# EAGLE design untitled (EAGLE 8.6.3)
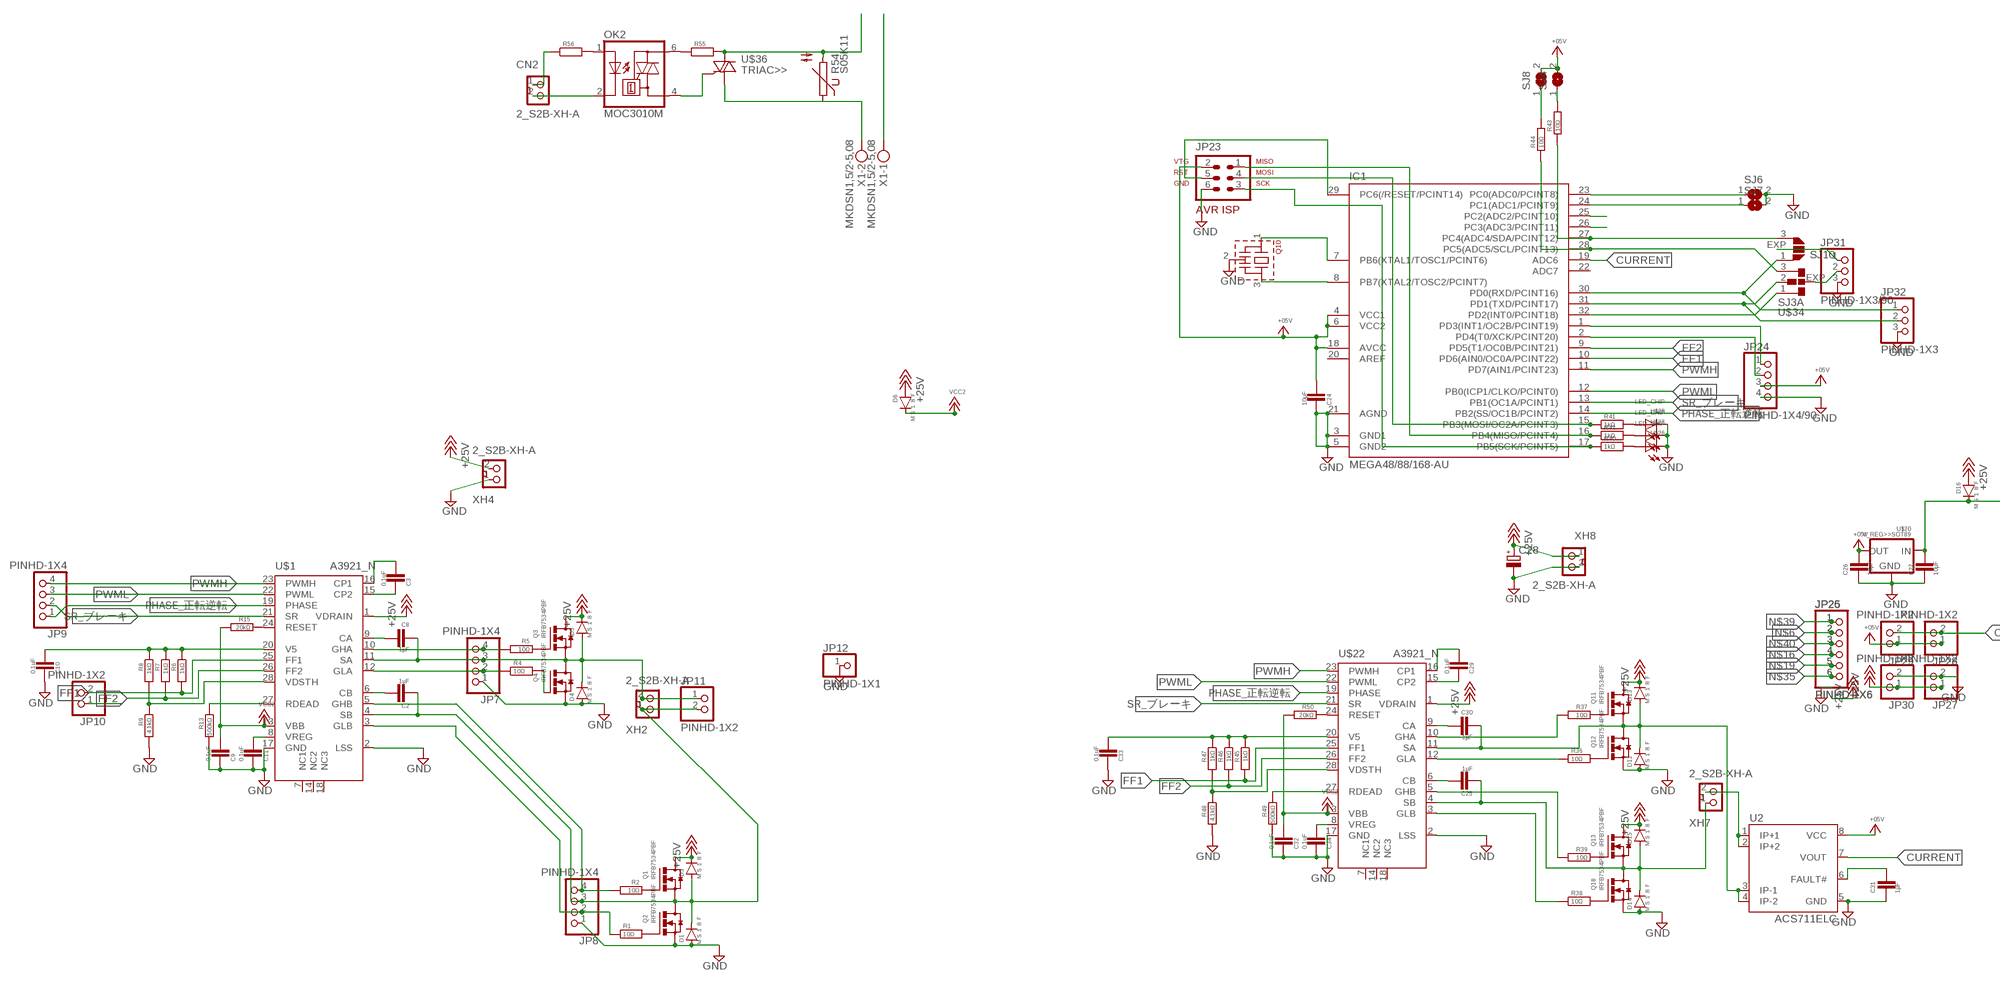
[diagram p0: schematic, sheet 1, part 1 of 2]
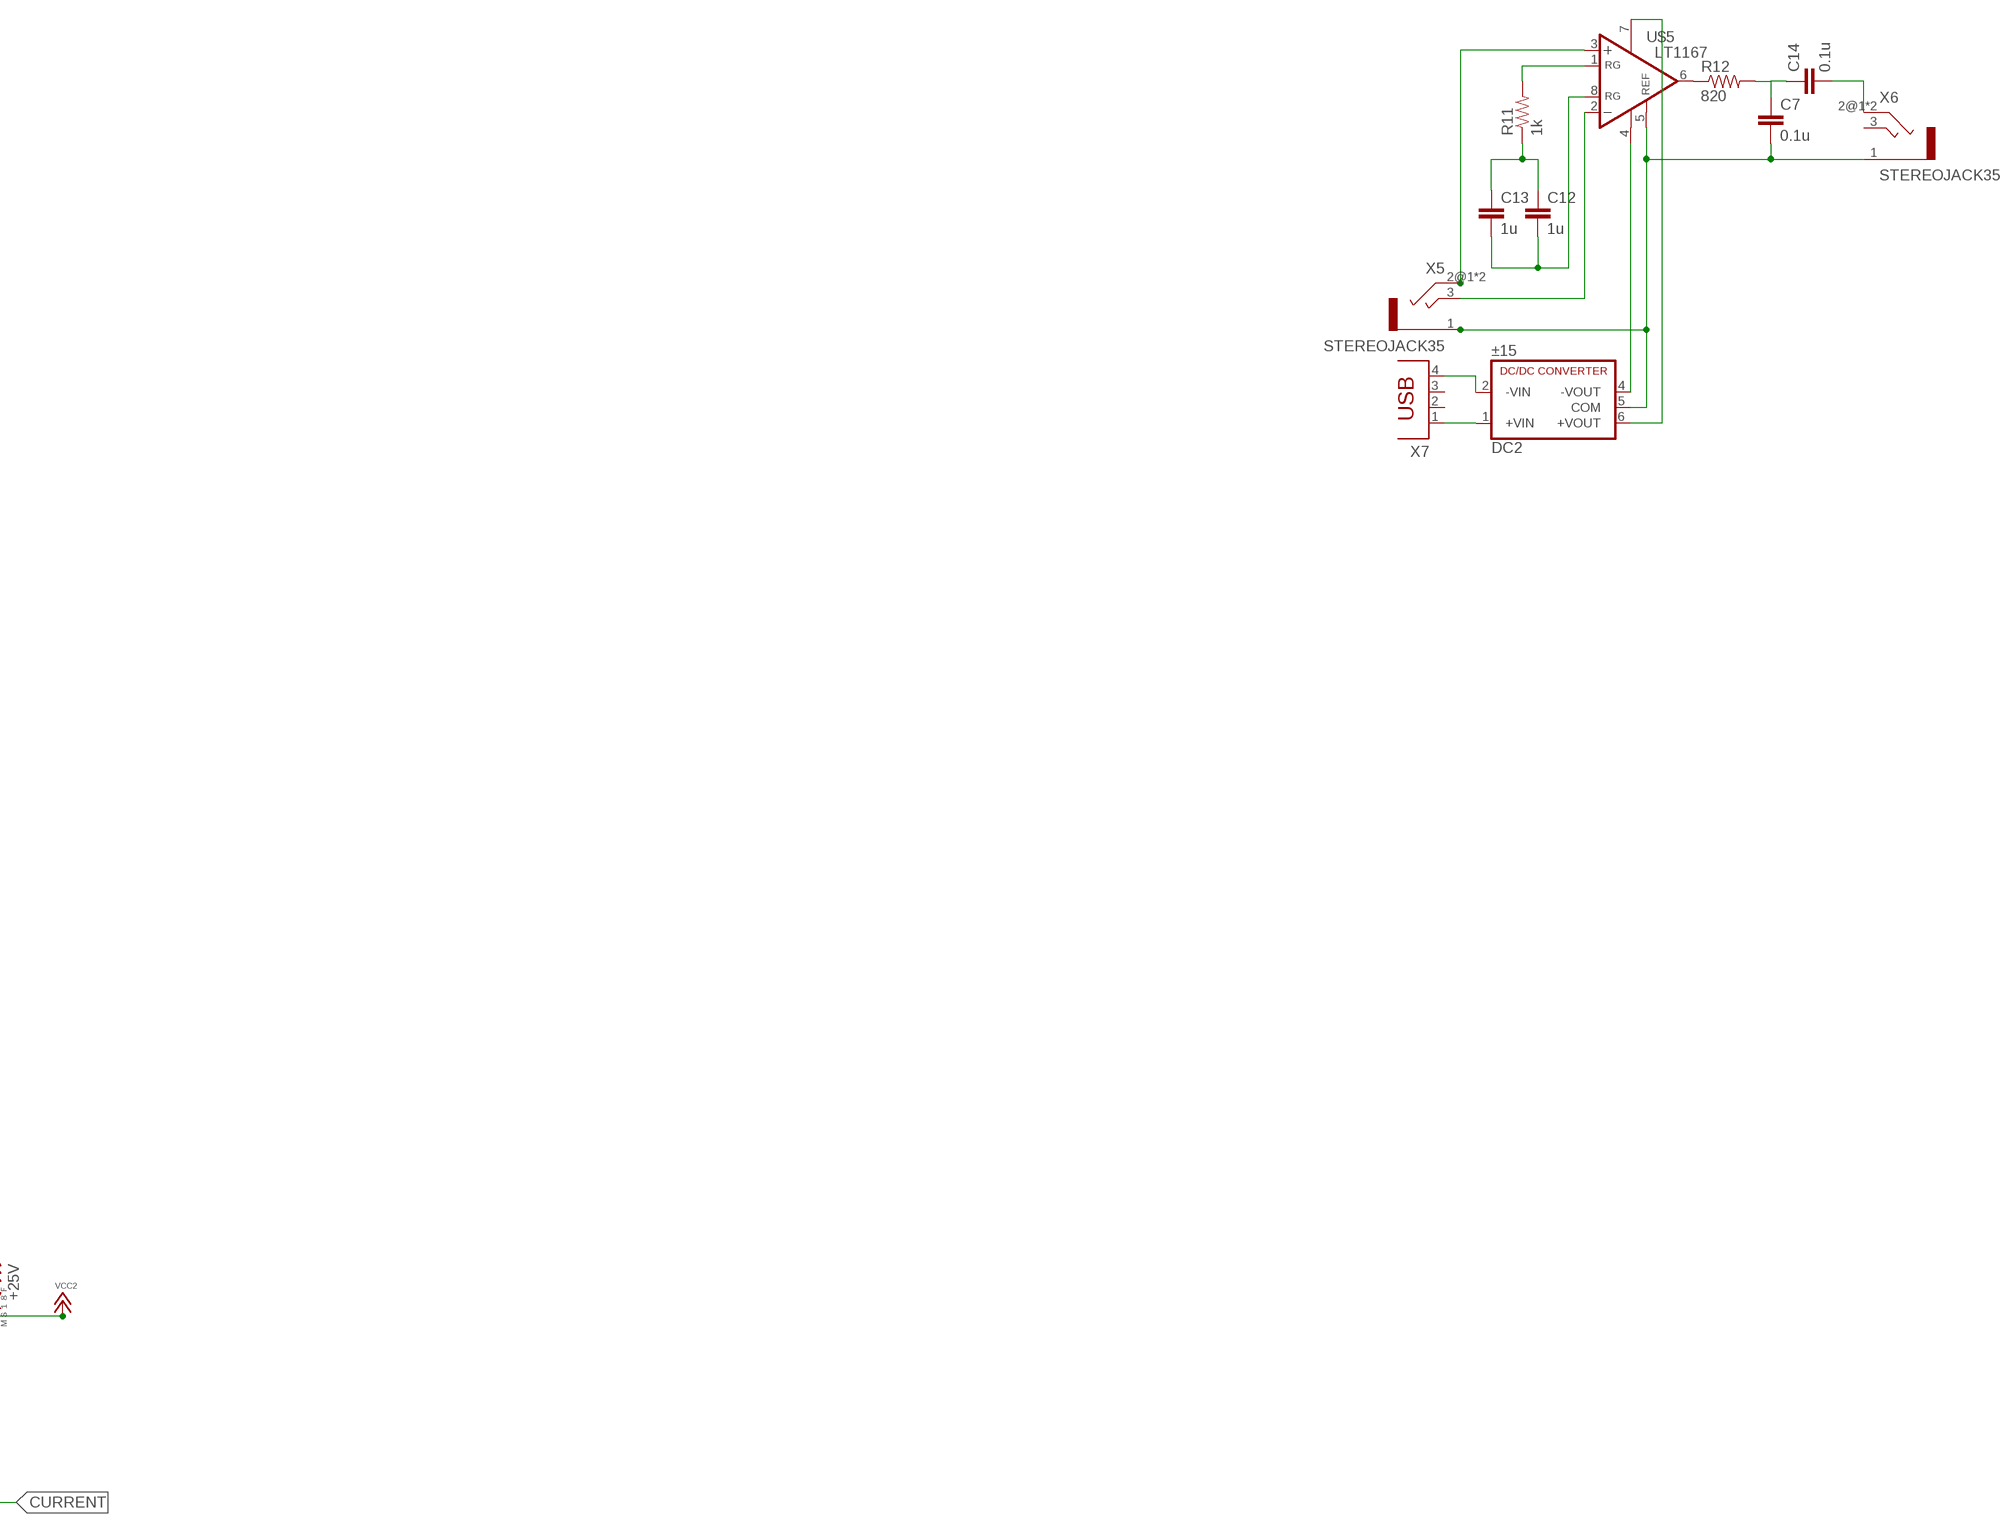
[diagram p1: schematic, sheet 1, part 2 of 2]

## Parts
C2  1μF  CAPACITOR>>2012  [2012]
C3  0.1uF  CAPACITOR>>2012  [2012]
C7  0.1u  C-EU050-024X044  [C050-024X044]
C8  1μF  CAPACITOR>>2012  [2012]
C9  0.1uF  CAPACITOR>>2012  [2012]
C10  0.1uF  CAPACITOR>>2012  [2012]
C11  0.1uF  CAPACITOR>>2012  [2012]
C12  1u  C-EU050-024X044  [C050-024X044]
C13  1u  C-EU050-024X044  [C050-024X044]
C14  0.1u  C-EU050-024X044  [C050-024X044]
C24  10μF  CAPACITOR>>2012  [2012]
C25  1μF  CAPACITOR>>2012  [2012]
C26  10μF  CAPACITOR>>2012  [2012]
C27  10μF  CAPACITOR>>2012  [2012]
C28  CPOL-EUUD-6,3X8,8  [UD-6,3X5,8_NICHICON]
C29  0.1uF  CAPACITOR>>2012  [2012]
C30  1μF  CAPACITOR>>2012  [2012]
C31  1μF  CAPACITOR>>2012  [2012]
C32  0.1uF  CAPACITOR>>2012  [2012]
C33  0.1uF  CAPACITOR>>2012  [2012]
C34  0.1uF  CAPACITOR>>2012  [2012]
CN2  2_S2B-XH-A  [S2B-XH-A]
D1  ＭＳ１８Ｆ  DIODE>>MS18F  [MS18F]
D3  ＭＳ１８Ｆ  DIODE>>MS18F  [MS18F]
D4  ＭＳ１８Ｆ  DIODE>>MS18F  [MS18F]
D5  ＭＳ１８Ｆ  DIODE>>MS18F  [MS18F]
D6  ＭＳ１８Ｆ  DIODE>>MS18F  [MS18F]
D12  ＭＳ１８Ｆ  DIODE>>MS18F  [MS18F]
D13  ＭＳ１８Ｆ  DIODE>>MS18F  [MS18F]
D14  ＭＳ１８Ｆ  DIODE>>MS18F  [MS18F]
D15  ＭＳ１８Ｆ  DIODE>>MS18F  [MS18F]
D16  ＭＳ１８Ｆ  DIODE>>MS18F  [MS18F]
DC2  ±15  MAU109  [NMA]
IC1  MEGA48/88/168-AU  [TQFP32-08]
JP7  PINHD-1X4  [1X04]
JP8  PINHD-1X4  [1X04]
JP9  PINHD-1X4  [1X04]
JP10  PINHD-1X2  [1X02]
JP11  PINHD-1X2  [1X02]
JP12  PINHD-1X1  [1X01]
JP23  AVR-ISP-6  [AVR-ISP-6]
JP24  PINHD-1X4/90  [1X04/90]
JP25  PINHD-1X6  [1X06]
JP26  PINHD-1X6  [1X06]
JP27  PINHD-1X2  [1X02]
JP28  PINHD-1X2  [1X02]
JP29  PINHD-1X2  [1X02]
JP30  PINHD-1X2  [1X02]
JP31  PINHD-1X3/90  [1X03/90]
JP32  PINHD-1X3  [1X03]
OK2  MOC3010M  [DIL06]
Q1  IRFB7534PBF  MOSFET_N>>TO252  [TO252]
Q2  IRFB7534PBF  MOSFET_N>>TO252  [TO252]
Q3  IRFB7534PBF  MOSFET_N>>TO252  [TO252]
Q4  IRFB7534PBF  MOSFET_N>>TO252  [TO252]
Q10  CSTLS_G  [CSTLS_G8]
Q11  IRFB7534PBF  MOSFET_N>>TO252  [TO252]
Q12  IRFB7534PBF  MOSFET_N>>TO252  [TO252]
Q13  IRFB7534PBF  MOSFET_N>>TO252  [TO252]
Q18  IRFB7534PBF  MOSFET_N>>TO252  [TO252]
R1  10Ω  REGISTER>>2012  [2012]
R2  10Ω  REGISTER>>2012  [2012]
R4  10Ω  REGISTER>>2012  [2012]
R5  10Ω  REGISTER>>2012  [2012]
R6  1kΩ  REGISTER>>2012  [2012]
R7  1kΩ  REGISTER>>2012  [2012]
R8  1kΩ  REGISTER>>2012  [2012]
R9  4.1kΩ  REGISTER>>2012  [2012]
R11  1k  R-US_0207/7  [0207/7]
R12  820  R-US_0207/7  [0207/7]
R13  500kΩ  REGISTER>>2012  [2012]
R15  20kΩ  REGISTER>>2012  [2012]
R36  10Ω  REGISTER>>2012  [2012]
R37  10Ω  REGISTER>>2012  [2012]
R38  10Ω  REGISTER>>2012  [2012]
R39  10Ω  REGISTER>>2012  [2012]
R40  1kΩ  REGISTER>>2012  [2012]
R41  1kΩ  REGISTER>>2012  [2012]
R42  1kΩ  REGISTER>>2012  [2012]
R43  10Ω  REGISTER>>2012  [2012]
R44  10Ω  REGISTER>>2012  [2012]
R45  1kΩ  REGISTER>>2012  [2012]
R46  1kΩ  REGISTER>>2012  [2012]
R47  1kΩ  REGISTER>>2012  [2012]
R48  4.1kΩ  REGISTER>>2012  [2012]
R49  500kΩ  REGISTER>>2012  [2012]
R50  20kΩ  REGISTER>>2012  [2012]
R54  S05K11  [S05K11]
R55  R-EU>>1/4W(8MM)  [1/4W(8MM)]
R56  R-EU>>1/4W(8MM)  [1/4W(8MM)]
SJ4  SJSS  [SJ_B]
SJ6  SJSS  [SJ_B]
SJ7  SJSS  [SJ_B]
SJ8  SJSS  [SJ_B]
SJ10  SJ2  [SJ2_A]
U2  ACS711ELC  [SOIC8]
U$1  A3921_N  [TSSOP28_N]
U$5  LT1167  [DIL08]
U$20  V_REG>>SOT89  [SOT89]
U$22  A3921_N  [TSSOP28_N]
U$26  LED_CHIP  [2012]
U$27  LED_CHIP  [2012]
U$28  LED_CHIP  [2012]
U$34  SJ3A  [SJ3_A]
U$36  TRIAC>>  [TO-220_BT]
X1  MKDSN1,5/2-5,08  [MKDSN1,5/2-5,08]
X5  STEREOJACK35  [STEREOJACK35]
X6  STEREOJACK35  [STEREOJACK35]
X7  PN87520  [PN87520]
XH2  2_S2B-XH-A  [S2B-XH-A]
XH4  2_S2B-XH-A  [S2B-XH-A]
XH7  2_S2B-XH-A  [S2B-XH-A]
XH8  2_S2B-XH-A  [S2B-XH-A]

## Nets
+5V: C24.1 C26.1 IC1.4(VCC1) IC1.6(VCC2) IC1.18(AVCC) JP23.2 JP24.3 JP28.1 JP29.1 SJ4.2 SJ8.2 U2.8(VCC) U$20.1(OUT) ; supply symbol labelled +05V
+18V: C28.+ D3.P$2(C) D5.P$2(C) D6.P$1(A) D13.P$2(C) D15.P$2(C) D16.P$1(A) JP27.1 JP30.1 Q1.3(D) Q3.3(D) Q11.3(D) Q13.3(D) U$1.1(VDRAIN) U$22.1(VDRAIN) XH4.2 XH8.1 ; supply symbol labelled +25V
CURRENT: IC1.19(ADC6) JP28.2 JP29.2 U2.7(VOUT)
FF1: IC1.10(PD6(AIN0/OC0A/PCINT22)) JP10.2 R6.2 R45.2 U$1.25(FF1) U$22.25(FF1)
FF2: IC1.9(PD5(T1/OC0B/PCINT21)) JP10.1 R7.2 R46.2 U$1.26(FF2) U$22.26(FF2)
GND: C9.2 C10.2 C11.2 C24.2 C26.2 C27.2 C28.- C31.2 C32.2 C33.2 C34.2 D1.P$1(A) D4.P$1(A) D12.P$1(A) D14.P$1(A) IC1.3(GND1) IC1.5(GND2) IC1.21(AGND) JP7.1 JP8.1 JP12.1 JP23.6 JP24.4 JP27.2 JP30.2 JP31.3 JP32.3 Q2.2(S) Q4.2(S) Q10.2(VSS) Q12.2(S) Q18.2(S) R9.2 R13.2 R48.2 R49.2 SJ6.2 SJ7.2 U2.5(GND) U$1.2(LSS) U$1.17(GND) U$20.2(GND) U$20.2.1(GND) U$22.2(LSS) U$22.17(GND) U$26.P$2(C) U$27.P$2(C) U$28.P$2(C) XH4.1 XH8.2
N$1: Q2.1(G) R1.2
N$2: Q1.1(G) R2.1
N$3: Q4.1(G) R4.2
N$6: C25.2 D14.P$2(C) D15.P$1(A) JP25.2 JP26.2 Q3.1(G) Q13.2(S) Q18.3(D) R5.1 U$22.4(SB) XH7.1
N$9: C3.1 U$1.16(CP1)
N$10: C3.2 U$1.15(CP2)
N$11: C8.1 U$1.9(CA)
N$15: JP7.4 R5.2 U$1.10(GHA)
N$16: JP25.4 JP26.4 R37.2 U$22.10(GHA)
N$17: JP7.2 R4.1 U$1.12(GLA)
N$18: C2.1 U$1.6(CB)
N$19: C30.2 D12.P$2(C) D13.P$1(A) JP25.5 JP26.5 Q11.2(S) Q12.3(D) U2.3(IP-1) U2.4(IP-2) U$22.11(SA)
N$20: R8.2 R9.1 U$1.28(VDSTH)
N$21: R13.1 U$1.27(RDEAD)
N$22: C2.2 D1.P$2(C) D3.P$1(A) JP8.3 JP11.2 Q1.2(S) Q2.3(D) U$1.4(SB) XH2.1
N$23: R15.1 U$1.24(RESET)
N$24: C11.1 U$1.8(VREG)
N$25: JP8.4 R2.2 U$1.5(GHB)
N$26: C8.2 D4.P$2(C) D5.P$1(A) JP7.3 JP11.1 Q3.2(S) Q4.3(D) U$1.11(SA) XH2.2
N$27: JP8.2 R1.1 U$1.3(GLB)
N$35: JP25.6 JP26.6 R36.1 U$22.12(GLA)
N$39: JP25.1 JP26.1 R39.2 U$22.5(GHB)
N$40: JP25.3 JP26.3 R38.1 U$22.3(GLB)
N$47: C7.2 DC2.5(COM) U$5.5(REF) X5.1 X6.1
N$48: U$5.2(-IN) X5.3
N$49: U$5.3(+IN) X5.2@1 X5.2@2
N$50: DC2.2(-VIN) X7.4
N$51: DC2.1(+VIN) X7.1
N$52: C12.2 C13.2 U$5.8(RG)
N$53: C12.1 C13.1 R11.1
N$54: R11.2 U$5.1(RG)
N$55: DC2.4(-VOUT) U$5.4(V-)
N$56: DC2.6(+VOUT) U$5.7(V+)
N$57: R12.1 U$5.6(OUT)
N$58: C7.1 C14.1 R12.2
N$59: C14.2 X6.2@1 X6.2@2
N$81: IC1.7(PB6(XTAL1/TOSC1/PCINT6)) Q10.1
N$82: IC1.8(PB7(XTAL2/TOSC2/PCINT7)) Q10.3
N$83: IC1.29(PC6(/RESET/PCINT14)) JP23.5
N$84: IC1.17(PB5(SCK/PCINT5)) JP23.3 R40.1
N$85: IC1.16(PB4(MISO/PCINT4)) JP23.1 R42.1
N$86: IC1.15(PB3(MOSI/OC2A/PCINT3)) JP23.4 R41.1
N$89: Q12.1(G) R36.2
N$90: Q11.1(G) R37.1
N$91: Q18.1(G) R38.2
N$92: Q13.1(G) R39.1
N$93: R44.2 SJ8.1
N$94: C29.1 U$22.16(CP1)
N$95: C29.2 U$22.15(CP2)
N$96: C30.1 U$22.9(CA)
N$97: C25.1 U$22.6(CB)
N$98: R47.2 R48.1 U$22.28(VDSTH)
N$99: R49.1 U$22.27(RDEAD)
N$100: C31.1 U2.6(FAULT#)
N$101: IC1.2(PD4(T0/XCK/PCINT20)) JP24.2
N$102: IC1.1(PD3(INT1/OC2B/PCINT19)) JP24.1
N$103: R40.2 U$26.P$1(A)
N$104: R42.2 U$27.P$1(A)
N$105: R41.2 U$28.P$1(A)
N$106: U2.1(IP+1) U2.2(IP+2) XH7.2
N$107: IC1.23(PC0(ADC0/PCINT8)) SJ6.1
N$108: IC1.24(PC1(ADC1/PCINT9)) SJ7.1
N$109: R43.2 SJ4.1
N$110: JP31.2 U$34.EXP
N$111: JP31.1 SJ10.EXP
N$112: IC1.32(PD2(INT0/PCINT18)) U$34.1
N$113: IC1.31(PD1(TXD/PCINT17)) JP32.2 U$34.2
N$114: IC1.30(PD0(RXD/PCINT16)) JP32.1 SJ10.1
N$115: IC1.28(PC5(ADC5/SCL/PCINT13)) R44.1 U$34.3
N$116: IC1.27(PC4(ADC4/SDA/PCINT12)) R43.1 SJ10.3
N$117: IC1.25(PC2(ADC2/PCINT10))
N$118: IC1.26(PC3(ADC3/PCINT11))
N$119: R50.1 U$22.24(RESET)
N$120: C34.1 U$22.8(VREG)
N$131: OK2.6(A2) R55.1
N$132: R54.2 R55.2 U$36.2(A2)
N$133: OK2.4(A1) U$36.1(G)
N$134: R54.1 U$36.3(A1) X1.2
N$135: OK2.1(A) R56.2
N$136: CN2.1 R56.1
N$137: X1.1
N$138: CN2.2 OK2.2(C)
PHASE_正転逆転: IC1.14(PB2(SS/OC1B/PCINT2)) JP9.1 U$1.19(PHASE) U$22.19(PHASE)
PWMH: IC1.11(PD7(AIN1/PCINT23)) JP9.4 U$1.23(PWMH) U$22.23(PWMH)
PWML: IC1.12(PB0(ICP1/CLKO/PCINT0)) JP9.3 U$1.22(PWML) U$22.22(PWML)
SR_ブレーキ: IC1.13(PB1(OC1A/PCINT1)) JP9.2 U$1.21(SR) U$22.21(SR)
V1: C10.1 R6.1 R7.1 R8.1 U$1.20(V5)
V3: C33.1 R45.1 R46.1 R47.1 U$22.20(V5)
VCC2: C9.1 C27.1 C32.1 D6.P$2(C) D16.P$2(C) R15.2 R50.2 U$1.13(VBB) U$20.3(IN) U$22.13(VBB)
Unconnected: IC1.20(AREF) IC1.22(ADC7) U$1.7(NC1) U$1.14(NC2) U$1.18(NC3) U$22.7(NC1) U$22.14(NC2) U$22.18(NC3) X6.3 X7.2 X7.3

## Library data of the parts
C2 C3 C8-C11 C24-C27 C29-C34 = !SMD:CAPACITOR>>
C7 C12-C14 = rcl:C-EU: CAPACITOR, European symbol
C28 = !rcl:CPOL-EU: POLARIZED CAPACITOR, European symbol
CN2 XH2 XH4 XH7 XH8 = !con-xh:2_: Wire-to-Board 2.5mm pitch top mount connector Source: http://www.jst-mfg.com/product/pdf/jpn/XH.pdf http://www.jst-mfg.com/product/detail.php?series=277
D1 D3-D6 D12-D16 = !diode:DIODE>>: DIODE
DC2 = dc-dc-converter:MAU109: DC-DC CONVERTER; MAU109: M-04135; MF: Minmax Technology Co., Ltd.; OC_FARNELL: 1021434; OC_NEWARK: 61K3064
IC1 = !avr:MEGA48/88/168
JP7-JP9 JP24 = !pinhead(ﾋﾟﾝﾍｯﾀﾞ):PINHD-1X4: PIN HEADER
JP10 JP11 JP27-JP30 = !pinhead(ﾋﾟﾝﾍｯﾀﾞ):PINHD-1X2: PIN HEADER
JP12 = !pinhead(ﾋﾟﾝﾍｯﾀﾞ):PINHD-1X1: PIN HEADER
JP23 = !avr:AVR-ISP-6: AVR ISP-6 Serial Programming Header
JP25 JP26 = !pinhead(ﾋﾟﾝﾍｯﾀﾞ):PINHD-1X6: PIN HEADER
JP31 JP32 = !pinhead(ﾋﾟﾝﾍｯﾀﾞ):PINHD-1X3: PIN HEADER
OK2 = optocoupler:MOC30*M: RANDOM-PHASE OPTOISOLATORS TRIAC DRIVER OUTPUT Source: http://www.fairchildsemi.com MOC3020-M.pdf; MF: FAIRCHILD SEMICONDUCTOR; MPN: MOC3010-M; OC_FARNELL: 1505423; OC_NEWARK: 72K8892
Q1-Q4 Q11-Q13 Q18 = !FET_transister_v-reg:MOSFET_N>>
Q10 = !murata-resonators(ｾﾗﾛｯｸ):CSTLS_G: Ceramic resonator 2.00 to 10.00 MHz
R1 R2 R4-R9 R13 R15 R36-R50 = !SMD:REGISTER>>
R11 R12 = rcl:R-US_: RESISTOR, American symbol
R54 = varistor:S05K11: VARISTOR
R55 R56 = !Resistor(抵抗):R-EU>>: RESISTOR, European symbol
SJ4 SJ6-SJ8 = !jumper:SJ: SMD solder JUMPER
SJ10 = !jumper:SJ2: SMD solder JUMPER
U2 = allegro:ACS711E: SENSOR CURRENT 3.3V 8-SOIC tested: YES (etherbotix)
U$1 U$22 = !irs(GateDriver):A3921_N
U$5 = linear-technology:LT1167
U$20 = !FET_transister_v-reg:V_REG>>
U$26-U$28 = !led:LED_CHIP
U$34 = !jumper:SJ3
U$36 = !FET_transister_v-reg:TRIAC>>
X1 = !con_phoenix-508(ﾀｰﾐﾅﾙ):MKDSN1,5/2-5,08: MKDSN 1,5/ 2-5,08 Printklemme Nennstrom: 13,5 A Nennspannung: 250 V Rastermaß: 5,08 mm Polzahl: 2 Anschlussart: Schraubanschluss Montage: Löten Anschlussrichtung Leiter/Platine: 0 ° Artikelnummer: 1729128 Source: http://eshop.phoenixcontact.com .. 1729128.pdf; MPN: MKDSN 1,5/2-5.08; OC_FARNELL: 1792903; OC_NEWARK: 30M2397
X5 X6 = con-lumberg:STEREOJACK35
X7 = con-berg:PN87520: BERG USB connector; OC_FARNELL: unknown; OC_NEWARK: unknown

## Board
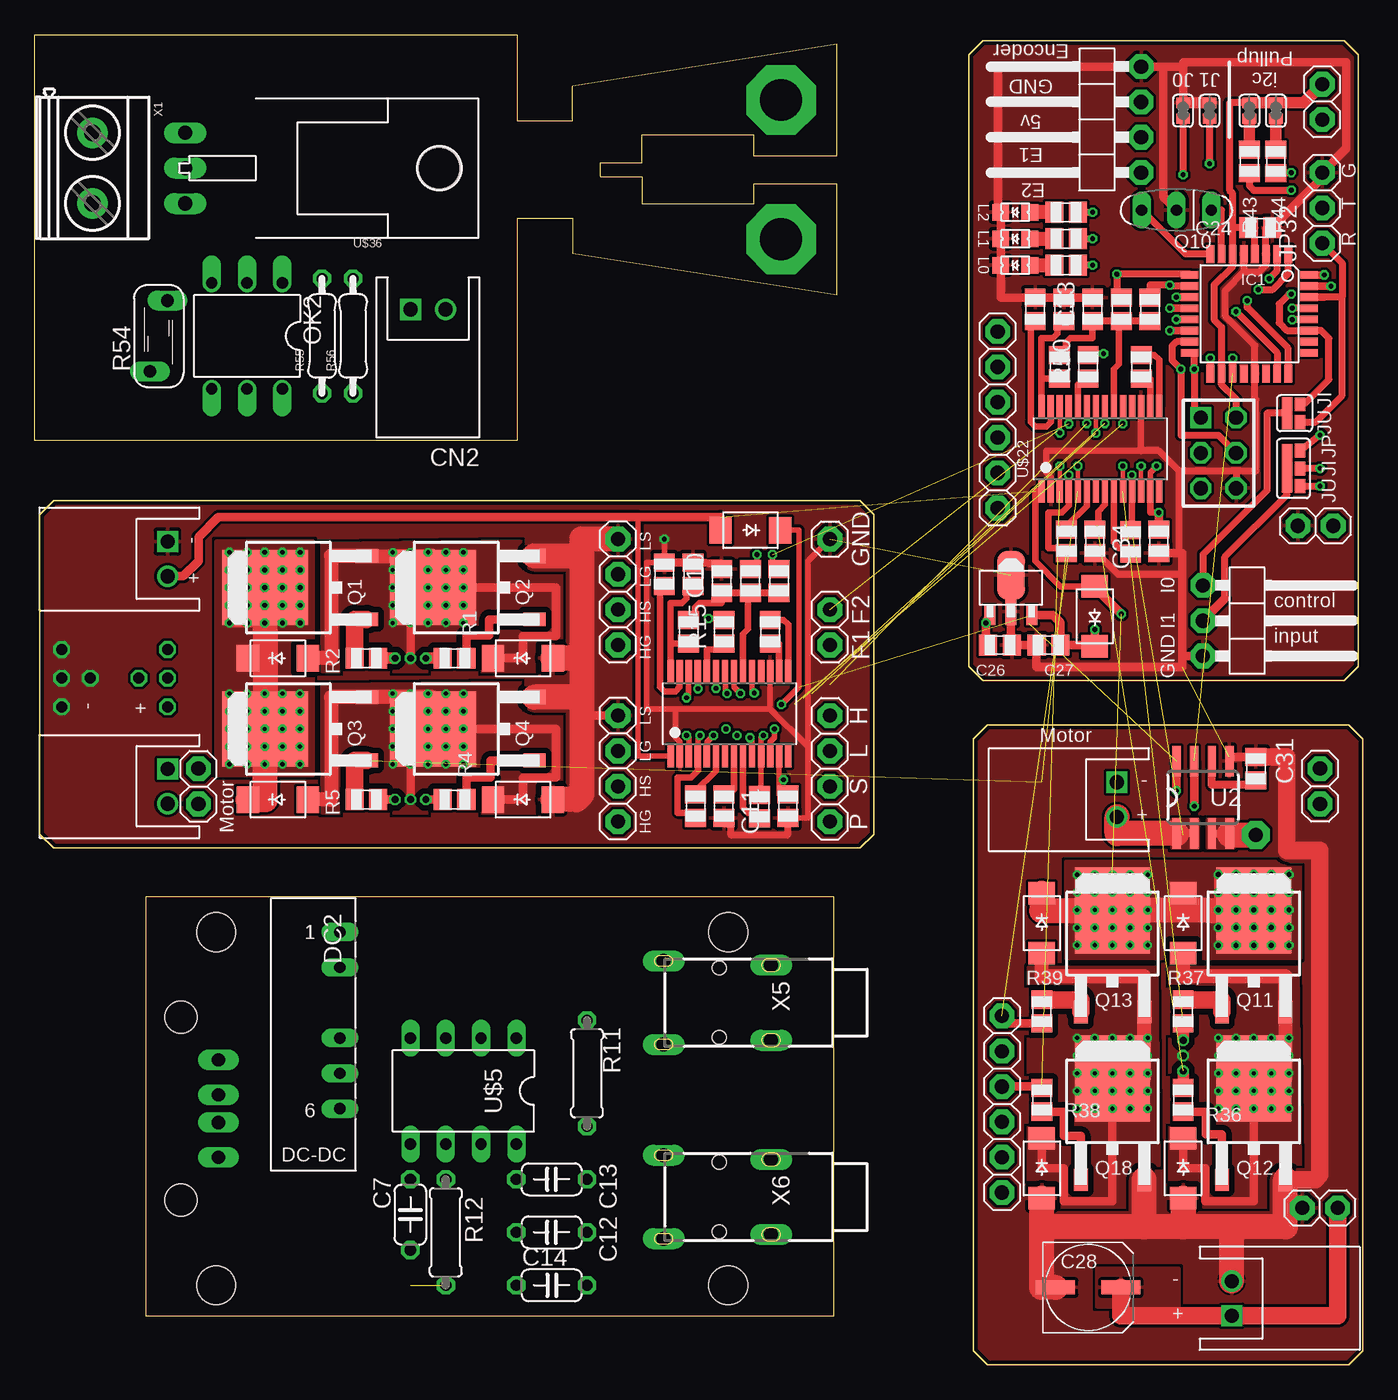
[diagram p2: board, top side]
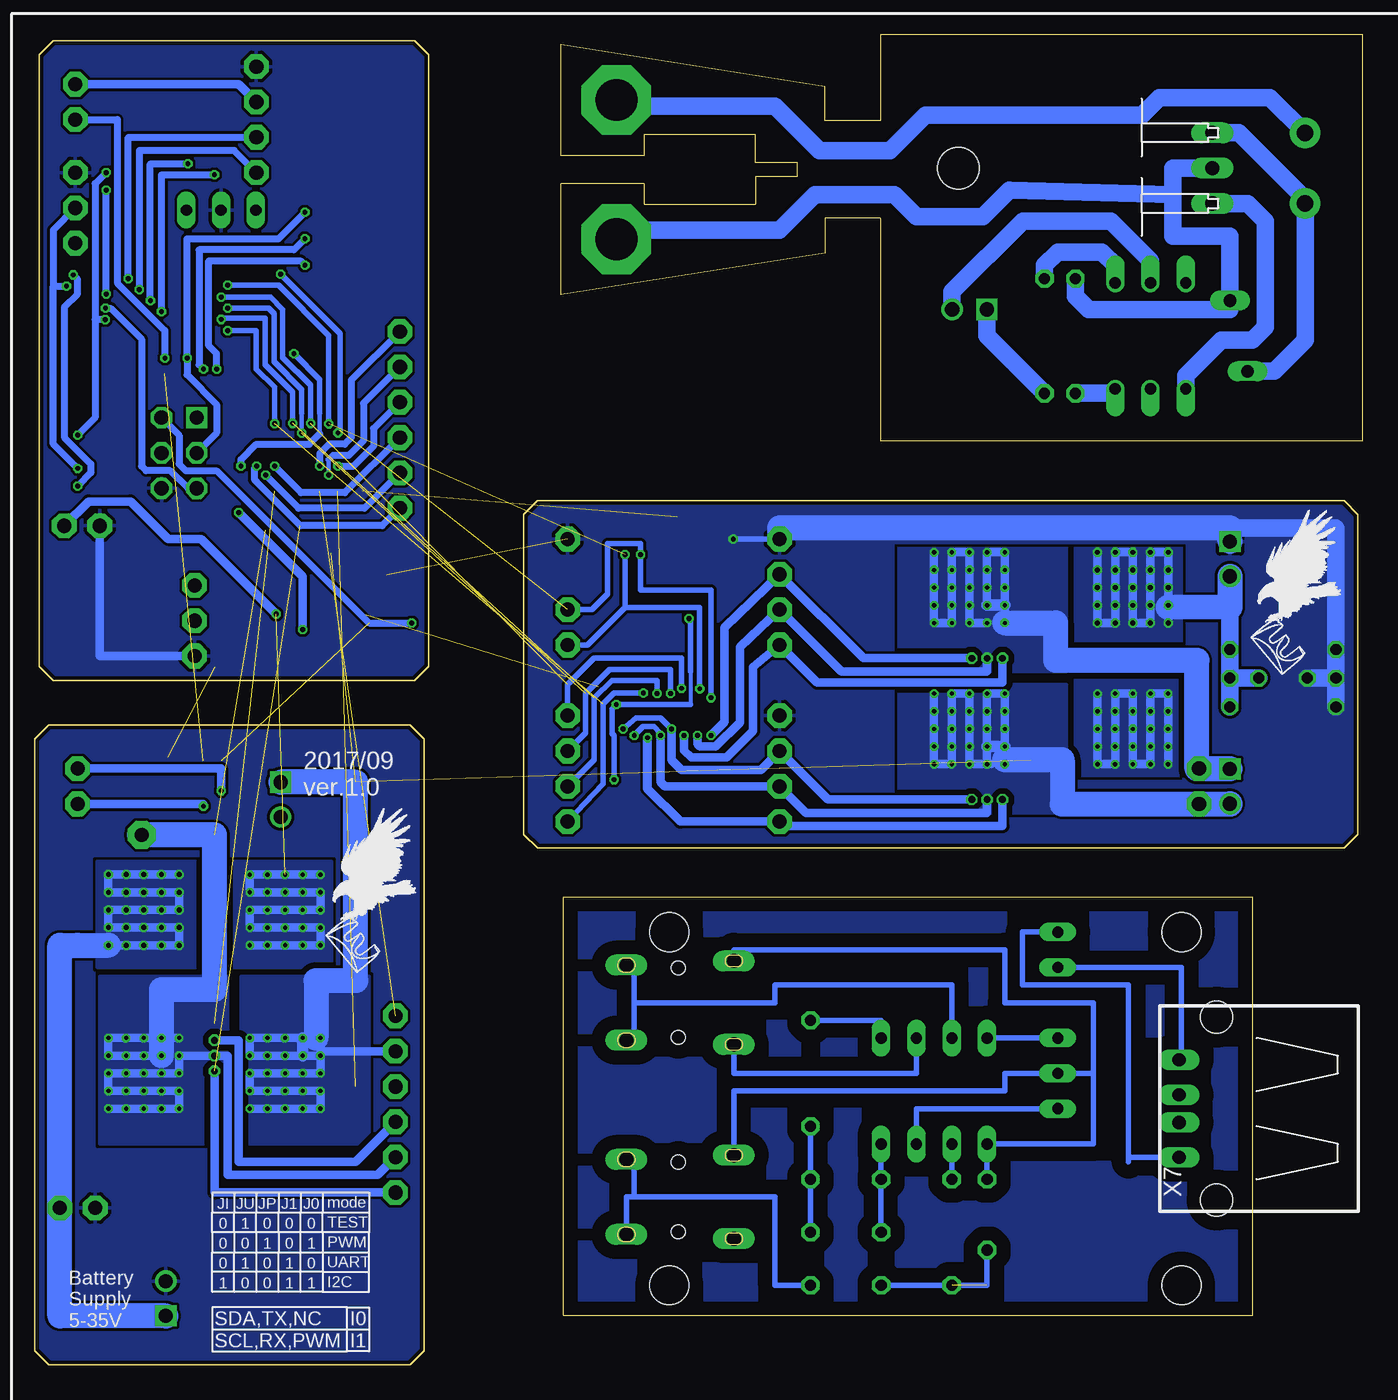
[diagram p3: board, bottom side, seen from below]

Size 95.49 x 95.63 mm. Coordinates in mm from the lower left corner, seen from the top.
Outline: 59.35,62.15 1.35,62.15 0.35,61.15 0.35,38.15 1.35,37.15 59.35,37.15 60.35,38.15 60.35,61.15 59.35,62.15
Outline: 95.49,1 95.49,45 94.49,46 68.49,46 67.49,45 67.49,1 68.49,0 94.49,0 95.49,1
Outline: 95.17,50.21 95.17,94.21 94.17,95.21 68.17,95.21 67.17,94.21 67.17,50.21 68.17,49.21 94.17,49.21 95.17,50.21
Outline: 34.66,82.44 38.66,82.44 38.66,79.94 57.66,76.94 57.66,84.94 51.66,84.94 51.66,83.44 43.66,83.44 43.66,85.44 40.66,85.44 40.66,86.44 43.66,86.44 43.66,88.44 51.66,88.44 51.66,86.94 57.66,86.94 57.66,94.94 38.66,91.94 38.66,89.44 34.66,89.44 34.66,95.63 0,95.63 0,66.44 34.66,66.44 34.66,82.44
Outline: 7.96,33.66 7.96,3.5 57.48,3.5 57.48,33.66 7.96,33.66
Copper layers (1*16): Top 0.035mm / dielectric 1.5mm / Bottom 0.035mm
Design rules "SeeedStudio_2layer_DRU_no_angle_20140221": minimum track width 6mil, minimum drill 12mil, track to track 6mil, track to pad 6mil, pad to pad 6mil, via to via 6mil, smd to smd 0mil, copper to edge 10mil, drill to drill 10mil, minimum pad ring 10mil, minimum via ring 6mil, stop-mask expansion 2mil, vias tented up to drill 100mil, thermal gap 10mil
Holes 2.8 mm at 49.87,31.11 49.87,5.71 13.04,31.11 13.04,5.71
Holes 3 mm at 29.07,86.04

### Footprints (pad centres in the part's own frame; a part is rotated, then mirrored left to right if it is on the bottom)
2012 = smd 1.3 x 1.5: 1 -0.85,0; 2 0.85,0
C050-024X044 = drill 0.813 octagon: 1 -2.54,0; 2 2.54,0
UD-6,3X5,8_NICHICON = smd 2.8 x 1: + 2.35,0; - -2.35,0
S2B-XH-A = drill 1.016 square: 1 1.25,0 | drill 1.016: 2 -1.25,0
MS18F = smd 1.6 x 1.9: P$1 -2.15,0; P$2 2.15,0
NMA = drill 0.813 long: 1 0,6.35; 2 0,3.81; 4 0,-1.27; 5 0,-3.81; 6 0,-6.35
TQFP32-08 = smd 1.27 x 0.559: 1 -4.293,2.8; 2 -4.293,2; 3 -4.293,1.2; 4 -4.293,0.4; 5 -4.293,-0.4; 6 -4.293,-1.2; 7 -4.293,-2; 8 -4.293,-2.8; 17 4.293,-2.8; 18 4.293,-2; 19 4.293,-1.2; 20 4.293,-0.4; 21 4.293,0.4; 22 4.293,1.2; 23 4.293,2; 24 4.293,2.8 | smd 0.559 x 1.27: 9 -2.8,-4.293; 10 -2,-4.293; 11 -1.2,-4.293; 12 -0.4,-4.293; 13 0.4,-4.293; 14 1.2,-4.293; 15 2,-4.293; 16 2.8,-4.293; 25 2.8,4.293; 26 2,4.293; 27 1.2,4.293; 28 0.4,4.293; 29 -0.4,4.293; 30 -1.2,4.293; 31 -2,4.293; 32 -2.8,4.293
1X04 = drill 1.016 pad 1.778 octagon: 1 -3.81,0; 2 -1.27,0; 3 1.27,0; 4 3.81,0
1X02 = drill 1.016 pad 1.778 octagon: 1 -1.27,0; 2 1.27,0
1X01 = drill 1.016 pad 1.778 octagon: 1 0,0
AVR-ISP-6 = drill 1.016 square: 1 -2.54,-1.27 | drill 1.016 octagon: 2 -2.54,1.27; 3 0,-1.27; 4 0,1.27; 5 2.54,-1.27; 6 2.54,1.27
1X04/90 = drill 1.016 pad 1.778 octagon: 1 -3.81,-3.81; 2 -1.27,-3.81; 3 1.27,-3.81; 4 3.81,-3.81
1X06 = drill 1.016 pad 1.778 octagon: 1 -6.35,0; 2 -3.81,0; 3 -1.27,0; 4 1.27,0; 5 3.81,0; 6 6.35,0
1X03/90 = drill 1.016 pad 1.778 octagon: 1 -2.54,-3.81; 2 0,-3.81; 3 2.54,-3.81
1X03 = drill 1.016 pad 1.778 octagon: 1 -2.54,0; 2 0,0; 3 2.54,0
DIL06 = drill 0.813 offset: 1 -2.54,-3.81; 2 0,-3.81; 3 2.54,-3.81; 4 2.54,3.81; 5 0,3.81; 6 -2.54,3.81
TO252 = smd 1 x 1.6: 1 -2.28,-4.8; 2 2.28,-4.8 | smd 5.4 x 6.2: 3 0,2.5
CSTLS_G8 = drill 0.813 long: 1 -2.5,0; 2 0,0; 3 2.5,0
0207/7 = drill 0.813 octagon: 1 -3.81,0; 2 3.81,0
S05K11 = drill 0.914 long: 1 -0.635,-2.54; 2 0.635,2.54
1/4W(8MM) = drill 0.8 pad 1.27 octagon: 1 -4.128,0; 2 4.128,0
SJ_B = smd 0.75 x 1: 1 -0.572,0; 2 0.572,0
SJ2_A = smd 1 x 0.75: 1 -0.635,-0.953; 3 0.635,-0.953 | smd 2.3 x 0.75: EXP 0,0
SOIC8 = smd 0.6 x 2.2: 1 -1.905,-2.6; 2 -0.635,-2.6; 3 0.635,-2.6; 4 1.905,-2.6; 5 1.905,2.6; 6 0.635,2.6; 7 -0.635,2.6; 8 -1.905,2.6
TSSOP28_N = smd 0.45 x 1.65: 1 -4.225,-3.05; 2 -3.575,-3.05; 3 -2.925,-3.05; 4 -2.275,-3.05; 5 -1.625,-3.05; 6 -0.975,-3.05; 7 -0.325,-3.05; 8 0.325,-3.05; 9 0.975,-3.05; 10 1.625,-3.05; 11 2.275,-3.05; 12 2.925,-3.05; 13 3.575,-3.05; 14 4.225,-3.05; 15 4.225,3.05; 16 3.575,3.05; 17 2.925,3.05; 18 2.275,3.05; 19 1.625,3.05; 20 0.975,3.05; 21 0.325,3.05; 22 -0.325,3.05; 23 -0.975,3.05; 24 -1.625,3.05; 25 -2.275,3.05; 26 -2.925,3.05; 27 -3.575,3.05; 28 -4.225,3.05
DIL08 = drill 0.813 long: 1 -3.81,-3.81; 2 -1.27,-3.81; 3 1.27,-3.81; 4 3.81,-3.81; 5 3.81,3.81; 6 1.27,3.81; 7 -1.27,3.81; 8 -3.81,3.81
SOT89 = smd 0.8 x 1.4: 1 -1.499,-1.981; 3 1.499,-1.981 | smd 0.8 x 1.9: 2 0,-1.727 | smd 2 x 3.5: 2.1 0,0.889
2012' = smd 1.2 x 1.2: P$1 -1.05,0; P$2 1.05,0
SJ3_A = smd 1 x 0.75: 1 -1.111,-0.953; 2 0.159,-0.953; 3 1.429,-0.953 | smd 3.5 x 0.75: EXP 0.159,0
TO-220_BT = drill 1.016 long: 1 2.54,-5.08; 2 0,-5.08; 3 -2.54,-5.08
MKDSN1,5/2-5,08 = drill 1.2 pad 2.184: 1 -2.54,0; 2 2.54,0
STEREOJACK35 = drill 1 pad 1.2 long: 1 -19.51,-5.92; 2@1 -19.21,1.81; 2@2 -13.81,1.81; 3 -13.51,-5.92 | hole 1: -19.01,-1.92; -14.01,-1.92
PN87520 = drill 0.95 long: 1 -3.5,2.71; 2 -1,2.71; 3 1,2.71; 4 3.5,2.71 | hole 2.3: -6.57,0; 6.57,0

### Placement (x,y rotation side)
C2  47.52,40.16 270 top
C3  52.89,52.7 90 top
C7  27.01,10.79 90 top
C8  52.12,40.13 90 top
C9  54.16,40.16 270 top
C10  49.39,56.36 90 top
C11  49.55,40.16 270 top
C12  37.17,9.53 180 top
C13  37.17,13.33 180 top
C14  37.17,5.71 0 top
C24  88.13,81.76 0 top
C25  74.19,59.21 270 top
C26  69.4,51.75 0 top
C27  72.89,51.75 180 top
C28  75.75,5.56 0 top
C29  79.56,71.75 90 top
C30  78.79,59.18 90 top
C31  87.81,42.86 90 top
C32  80.83,59.21 270 top
C33  76.06,75.88 90 top
C34  76.22,59.21 270 top
CN2  28.28,75.88 180 top
D1  35.11,50.8 180 top
D3  17.48,50.8 180 top
D4  35.11,40.64 180 top
D5  17.48,40.64 180 top
D6  51.46,60.01 0 top
D12  82.57,14.13 90 top
D13  82.57,31.75 90 top
D14  72.41,14.13 90 top
D15  72.41,31.75 90 top
D16  76.22,53.82 270 top
DC2  21.93,24.77 0 top
IC1  87.34,75.56 270 top
JP7  41.93,42.86 270 top
JP8  41.93,55.56 270 top
JP9  57.17,42.86 90 top
JP10  57.17,53.02 270 top
JP11  11.77,41.59 90 top
JP12  57.17,59.37 90 top
JP23  85.11,65.56 270 top
JP24  75.75,89.53 90 top
JP25  69.56,18.73 270 top
JP26  69.24,67.94 270 top
JP27  92.1,60.32 180 top
JP28  92.57,90.8 270 top
JP29  92.42,41.59 270 top
JP30  92.42,11.27 180 top
JP31  87.81,53.5 270 top
JP32  92.57,83.19 90 top
OK2  15.26,73.98 180 top
Q1  19.07,55.88 90 top
Q2  31.14,55.88 90 top
Q3  19.07,45.72 90 top
Q4  31.14,45.72 90 top
Q10  82.1,83.03 180 top
Q11  87.65,30.16 0 top
Q12  87.65,18.1 0 top
Q13  77.49,30.16 0 top
Q18  77.49,18.1 0 top
R1  30.19,50.8 0 top
R2  23.84,50.8 0 top
R4  30.19,40.64 0 top
R5  23.84,40.64 0 top
R6  53.52,56.36 90 top
R7  51.46,56.36 90 top
R8  47.01,52.7 270 top
R9  47.33,56.83 90 top
R11  39.71,20.95 90 top
R12  29.55,9.53 270 top
R13  45.27,56.83 90 top
R15  49.55,52.7 90 top
R36  82.57,19.05 270 top
R37  82.57,25.4 270 top
R38  72.41,19.05 270 top
R39  72.41,25.4 270 top
R40  74.16,82.87 180 top
R41  74.16,79.06 180 top
R42  74.16,80.96 180 top
R43  87.34,86.52 90 top
R44  89.24,86.52 90 top
R45  80.19,75.88 90 top
R46  78.13,75.88 90 top
R47  73.68,71.75 270 top
R48  74,75.88 90 top
R49  71.94,75.88 90 top
R50  75.75,71.75 90 top
R54  8.91,73.98 0 top
R55  20.66,73.98 90 top
R56  22.88,73.98 90 top
SJ4  87.34,90.17 90 top
SJ6  82.57,90.17 90 top
SJ7  84.48,90.17 90 top
SJ8  89.24,90.17 90 top
SJ10  90.03,68.42 90 top
U2  84,40.8 0 top
U$1  49.95,46.81 0 top
U$5  30.82,19.69 180 top
U$20  70.19,55.88 0 top
U$22  76.62,65.86 0 top
U$26  LED_CHIP  [2012']  70.51,82.87 180 top
U$27  LED_CHIP  [2012']  70.51,80.96 180 top
U$28  LED_CHIP  [2012']  70.51,79.06 180 top
U$34  90.03,64.29 90 top
U$36  15.9,86.04 270 top
X1  4.15,86.04 270 top
X5  51.14,9.53 270 top
X6  51.14,-4.45 270 top
X7  10.5,18.41 90 bottom
XH2  9.55,41.59 90 top
XH4  9.55,57.94 90 top
XH7  77.81,40.64 90 top
XH8  86.07,4.76 270 top

### Tracks (layer width: path | path; a pad name or v marks a point on that pad's centre or on a via)
+5V  (via drill 0.35)  (1 unrouted)
  Top 0.508: IC1.4 87.73,81.76 C24.1 | 86.14,81.76 IC1.6 86.14,78.97 84.8,77.63 84.8,75.15 85.34,74.61 IC1.18 85.34,70.49 86.38,69.44 JP23.2 | 86.77,81.76 C24.1 | C24.1 86.14,81.76 | SJ4.2 85.91,90.74 85.91,84.46 86.14,84.23 86.14,81.76
  Top 0.61: U2.8 v82.1,41.28 | U$20.1 68.39,53.42 v68.39,53.34 68.39,51.75 C26.1
  Top 0.813: SJ4.2 SJ8.2 91.24,90.74 JP28.1
  Bottom 0.508: JP23.2 85.11,66.83 85.11,64.77 84.64,64.29 82.41,64.29 71.46,53.34 v68.39,53.34
  Bottom 0.61: JP29.1 82.1,42.86 v82.1,41.28 | JP28.1 80.83,92.08 JP24.3
+18V  (via drill 0.3, 0.35, 0.8)  (2 unrouted)
  Top 0.406: 43.36,60.96 43.36,43.76 U$1.1 45.27,43.76
  Top 0.457: D16.P$1 73.76,55.97 71.94,57.78 71.94,62.81 U$22.1
  Top 0.61: Q3.3 v17.8,45.72 | Q1.3 16.57,53.34 v13.99,53.34 | D6.P$1 49.31,60.96 43.36,60.96 13.2,60.96 11.77,59.53 11.77,57.78 10.68,56.69 XH4.2 | Q13.3 v77.49,31.43 | Q11.3 85.11,32.66 v85.11,35.24 | v78.13,53.98 76.22,55.88 D16.P$1
  Top 1.27: 16.57,52.7 16.57,50.8 D3.P$2 | v15.26,45.72 Q3.3 15.94,45.42 | 84.48,32.66 82.57,32.66 D13.P$2 | v77.49,33.97 Q13.3 77.2,33.3 | JP30.1 93.69,3.51 XH8.1 78.1,3.51 C28.+
  Top 1.8: Q1.3 16.57,52.7 Q3.3 16.57,40.64 D5.P$2 | Q11.3 84.48,32.66 Q13.3 72.41,32.66 D15.P$2
  Bottom 0.61: v13.99,43.18 v13.99,44.45 v13.99,45.72 v13.99,46.99 v13.99,48.26 v15.26,48.26 v15.26,46.99 v15.26,45.72 v15.26,44.45 v15.26,43.18 v16.53,43.18 v16.53,44.45 | 16.53,44.29 v16.53,45.72 v16.53,46.99 v16.53,48.26 v17.8,48.26 v17.8,46.99 v17.8,45.72 v17.8,44.45 v17.8,43.18 v19.07,43.18 v19.07,44.45 v19.07,45.72 v19.07,46.99 v19.07,48.26 | 13.99,54.45 v13.99,53.34 | v13.99,54.61 v13.99,55.88 v13.99,57.15 v13.99,58.42 v15.26,58.42 v15.26,57.15 v15.26,55.88 v15.26,54.61 | 15.26,54.45 v15.26,53.34 v16.53,53.34 16.53,54.45 | v16.53,54.61 v16.53,55.88 v16.53,57.15 v16.53,58.42 v17.8,58.42 v17.8,57.15 v17.8,55.88 v17.8,54.61 | 17.8,54.45 v17.8,53.34 v19.07,53.34 19.07,54.45 | v19.07,54.61 v19.07,55.88 v19.07,57.15 v19.07,58.42 | v74.95,35.24 v76.22,35.24 v77.49,35.24 v78.76,35.24 v80.03,35.24 v80.03,33.97 v78.76,33.97 v77.49,33.97 v76.22,33.97 v74.95,33.97 v74.95,32.7 v76.22,32.7 | 76.06,32.7 v77.49,32.7 v78.76,32.7 v80.03,32.7 v80.03,31.43 v78.76,31.43 v77.49,31.43 v76.22,31.43 v74.95,31.43 v74.95,30.16 v76.22,30.16 v77.49,30.16 v78.76,30.16 v80.03,30.16 | v85.11,35.24 86.22,35.24 | v86.38,35.24 v87.65,35.24 v88.92,35.24 v90.19,35.24 v90.19,33.97 v88.92,33.97 v87.65,33.97 v86.38,33.97 | 86.22,33.97 v85.11,33.97 v85.11,32.7 86.22,32.7 | v86.38,32.7 v87.65,32.7 v88.92,32.7 v90.19,32.7 v90.19,31.43 v88.92,31.43 v87.65,31.43 v86.38,31.43 | 86.22,31.43 v85.11,31.43 v85.11,30.16 86.22,30.16 | v86.38,30.16 v87.65,30.16 v88.92,30.16 v90.19,30.16 | JP27.1 91.62,62.07 88.61,62.07 85.91,59.37 83.53,59.37 v78.13,53.98
  Bottom 1.27: v9.55,47.31 v9.55,49.37 | v9.55,49.37 v9.55,51.43 9.55,54.45 | v7.48,49.37 v9.55,49.37
  Bottom 1.8: XH4.2 9.55,54.45 13.99,54.47 13.99,54.45 | 92.42,30.16 v90.19,30.16 93.69,30.16 JP30.1 93.69,3.51 XH8.1
  pour Top (isolate 0.406, rank 2, no thermals): 13.04,59.21 13.04,42.39 20.02,42.39 20.02,59.21
  pour Bottom (isolate 0.406, rank 2, no thermals): 13.04,42.39 13.04,59.21 20.66,59.21 20.66,42.39
  pour Top (isolate 0.406, rank 2, no thermals): 90.99,36.2 74.16,36.2 74.16,29.21 90.99,29.21
  pour Bottom (isolate 0.406, rank 2, no thermals): 74.16,36.2 90.99,36.2 90.99,28.58 74.16,28.58
  pour Top (isolate 0.406): 76.38,6.98 82.26,6.98 82.26,4.13 76.38,4.13
CURRENT  (via drill 0.35)  (1 unrouted)
  Top 0.55: IC1.19 v86.14,72.39
  Top 0.61: U2.7 v83.37,40.16
  Bottom 0.508: JP28.2 89.56,89.53 89.56,77.79 86.14,74.36 v86.14,72.39
  Bottom 0.61: JP29.2 83.37,40.32 v83.37,40.16
FF1  (via drill 0.35)  (1 unrouted)
  Top 0.406: R6.2 53.05,57.21 v53.05,58.26
  Top 0.457: U$1.25 v47.68,48.61 | U$22.25 v74.35,67.66
  Top 0.508: IC1.10 81.62,77.56 v81.62,77.63 80.19,77.63 R45.2
  Bottom 0.406: v47.68,48.61 47.68,54.45 53.05,54.45 | v53.05,58.26 53.05,54.45 | JP10.2 55.74,51.75 53.05,54.45 | v81.62,77.63 77.97,77.63 74.35,74.01 v74.35,67.66
FF2  (via drill 0.35)  (1 unrouted)
  Top 0.34: U$22.26 v73.7,67.01
  Top 0.406: R7.2 51.93,57.21 v51.93,58.26 | v46.87,47.96 47,48.08 47,49.82 U$1.26
  Top 0.508: IC1.9 83.04,78.42 v77.81,78.42 77.81,76.73 R46.2
  Bottom 0.406: JP10.1 55.43,54.29 54.31,55.4 54.31,59.06 51.93,59.06 v51.93,58.26 51.93,55.72 46.87,55.72 v46.87,47.96 | v73.7,67.01 73.52,67.18 73.52,74.14 v77.81,78.42
GND  (via drill 0.35, 0.8)  (2 unrouted)
  Top 0.406: U$1.17 52.88,47.15 | U$1.2 46.38,44.77 46.06,45.09 46.06,47.15 | 46.06,47.15 52.88,47.15 | C9.2 55.59,39.31 55.59,44.44 | 46.06,47.15 44,47.15 44,57.68 45.74,57.68 | R13.2 v45.27,59.37 | 52.88,47.15 55.59,44.44 | JP12.1 55.59,57.78 55.59,44.44
  Top 0.457: U$22.2 73.05,63.82 72.73,64.14 72.73,65.72 79.55,65.72 U$22.17 | U$20.2 U$20.2.1
  Top 0.508: 49.71,39.31 C11.2 49.55,38.89 50.03,38.89 50.03,38.1 54.16,38.1 C9.2 | C24.2 88.54,81.76 IC1.3 88.54,79.06 88.06,78.58 86.94,78.58 | U$26.P$2 69.24,82.93 69.24,83.19 | 86.38,64.29 87.81,64.29 87.81,69.37 87.73,69.37 IC1.21 87.73,73.28 85.61,75.41 85.61,77.25 86.94,78.58 | 86.38,64.29 JP23.6 | 86.94,78.98 IC1.5 86.94,78.59 86.94,78.58 | 82.51,56.83 77.91,56.83 76.38,58.36 C34.2 | 82.26,64.29 86.38,64.29 | 82.26,64.29 82.26,58.36 | 79.55,65.72 80.83,65.72 82.26,64.29
  Top 0.559: 87.81,43.4 C31.2
  Top 0.61: C10.2 49.39,57.63 R9.2 45.74,57.68 R13.2 | JP7.1 39.38,46.67 39.32,48 | C31.2 85.91,43.71 U2.5 | 69.24,83.19 69.24,93.35 JP24.4 81.14,93.35 | 82.51,50.96 82.51,56.83 82.51,58.36 C32.2 | JP31.3 82.51,50.96 | U$20.2 70.19,51.43 C26.2 C27.2 72.04,50.17 82.51,50.17 82.51,50.96 | 70.83,56.29 U$20.2.1 | 81.14,93.35 82.57,93.35 | 82.57,93.35 SJ6.2 | 81.14,93.35 81.14,83.98 Q10.2 | C33.2 R48.2 R49.2 69.46,76.73 U$28.P$2 U$27.P$2 U$26.P$2 | 82.57,93.35 82.57,93.66 94.32,93.66 94.32,87.47 JP32.3 92.57,85.35 C24.2
  Top 0.813: SJ6.2 SJ7.2
  Top 1.27: 39.39,58.16 39.32,58.16 | C31.2 90.03,43.71 90.03,36.99 92.42,36.99 92.42,13.65 92.06,13.3 Q12.2 89.93,11.27 89.93,9.92 89.93,9.84 | 86.05,6.03 XH8.2
  Top 1.8: 39.32,58.16 39.32,50.8 | 39.23,50.8 D1.P$1 39.32,50.8 | 39.32,50.8 39.32,48 | D4.P$1 38.95,40.64 39.32,41.01 39.32,48 | 39.32,58.16 Q2.2 | 39.32,48 Q4.2 | JP8.1 39.32,59.37 39.32,58.16 | 86.07,9.92 89.93,9.92 Q12.2 | XH8.2 86.07,9.92 | 86.07,9.92 82.57,9.92 | 82.57,10 D12.P$1 82.57,9.92 | 82.57,9.92 79.77,9.92 | C28.- 72.41,5.56 72.41,10.29 | 72.41,10.29 D14.P$1 | 79.77,9.92 72.79,9.92 72.41,10.29 | JP30.2 89.93,11.27 | 79.77,9.92 Q18.2
  Bottom 0.406: v45.27,59.37 42.73,59.37 41.93,60.17
  Bottom 0.61: JP27.2 90.83,50.96 JP31.3
  Bottom 1.27: v1.93,47.31 v1.93,49.37 | v1.93,49.37 v1.93,51.43 1.93,60.17 9.55,60.17 | v1.93,49.37 v3.99,49.37
  Bottom 1.8: XH4.1 9.55,60.17 41.93,60.17 JP8.1
  pour Bottom (isolate 0.203, rank 6): 59.35,62.15 60.35,61.15 60.35,38.15 59.35,37.15 1.35,37.15 0.35,38.15 0.35,61.15 1.35,62.15
  pour Top (isolate 0.203, rank 6): 59.35,62.15 60.35,61.15 60.35,38.15 59.35,37.15 1.35,37.15 0.35,38.15 0.35,61.15 1.35,62.15
  pour Bottom (isolate 0.203, rank 6): 95.49,1 94.49,0 68.49,0 67.49,1 67.49,45 68.49,46 94.49,46 95.49,45
  pour Top (isolate 0.203, rank 6): 95.49,1 94.49,0 68.49,0 67.49,1 67.49,45 68.49,46 94.49,46 95.49,45
  pour Top (isolate 0.203, rank 6): 95.17,50.21 94.17,49.21 68.17,49.21 67.17,50.21 67.17,94.21 68.17,95.21 94.17,95.21 95.17,94.21
  pour Bottom (isolate 0.203, rank 6): 95.17,50.21 94.17,49.21 68.17,49.21 67.17,50.21 67.17,94.21 68.17,95.21 94.17,95.21 95.17,94.21
GND2
  pour Bottom (isolate 1.016, no thermals): 57.49,33.66 7.96,33.66 7.96,3.17 57.49,3.17
N$1
  Top 0.61: R1.2 31.03,52.44 32.67,52.44 32.67,53.6 Q2.1
N$2
  Top 1.27: R2.1 22.98,53.6 Q1.1
N$3
  Top 0.61: Q4.1 32.78,43.44 32.78,42.23 31.03,42.23 R4.2
N$6  (via drill 0.3, 0.35)  (2 unrouted)
  Top 0.457: v74.35,63.98 U$22.4 74.35,61.78 73.84,61.28 72.89,61.28 72.89,58.74 74.19,58.74 C25.2
  Top 0.61: 77.49,18.57 77.49,11.75 74,11.75 74,14.13 72.41,14.13 D14.P$2
  Top 0.813: 77.49,18.57 Q18.3
  Top 1.016: Q13.2 79.77,20.6 Q18.3 | 79.77,25.4 Q13.2 | Q13.2 79.77,27.94 72.41,27.94 D15.P$1
  Top 1.27: Q3.1 22.98,43.44 R5.1
  Bottom 0.34: v74.35,63.98 74.35,65.09
  Bottom 0.457: 74.35,65.09 74.03,65.41 74,65.41
  Bottom 0.508: 74,65.41 72.89,65.41 71.86,66.44 71.86,69.14 JP26.2
  Bottom 0.61: v74.95,23.49 v76.22,23.49 v77.49,23.49 v78.76,23.49 v80.03,23.49 v80.03,22.22 v78.76,22.22 v77.49,22.22 v76.22,22.22 v74.95,22.22 | v80.03,18.42 v78.76,18.42 v77.49,18.42 v76.22,18.42 v74.95,18.42 v74.95,19.69 v76.22,19.69 v77.49,19.69 v78.76,19.69 v80.03,19.69 v80.03,20.95 v78.76,20.95 v77.49,20.95 v76.22,20.95 v74.95,20.95 v74.95,22.22 | JP25.2 74.95,22.54 v74.95,22.22
  Bottom 0.813: v76.22,22.22 v76.22,23.49
  Bottom 1.8: 75.27,23.49 75.27,27.62 72.41,27.62 72.41,41.89 XH7.1
  pour Top (isolate 0.406, rank 3, no thermals): 71.46,28.58 71.46,11.11 78.6,11.11 78.6,14.29 80.83,14.29 80.67,28.58
  pour Bottom (isolate 0.406, rank 3, no thermals): 71.46,15.88 71.46,27.94 80.67,27.94 80.67,15.88
N$9
  Top 0.457: C3.1 53.53,51.85 U$1.16
N$10
  Top 0.457: C3.2 53.84,53.56 54.18,53.21 U$1.15
N$11
  Top 0.457: C8.1 52.12,39.69 51.3,39.69 50.93,40.06 U$1.9
N$15  (via drill 0.35, 0.5)
  Top 0.406: U$1.10 51.58,44.93 v51.42,45.09
  Top 0.61: R5.2 v25.9,40.64
  Bottom 0.508: v51.42,45.09 51.42,43.5 51.42,42.35
  Bottom 0.61: v25.9,40.64 25.9,38.74 41.62,38.74 JP7.4 49.08,39.05 51.42,41.4 | 51.42,41.4 51.46,41.43 | 51.46,41.43 51.42,41.47 51.42,43.5 | 51.46,41.43 51.46,45.05 v51.42,45.09 51.42,41.4
N$16  (via drill 0.35, 0.5)  (1 unrouted)
  Top 0.34: v78.25,64.61 U$22.10
  Top 0.813: R37.2 v82.57,23.34
  Bottom 0.508: v78.25,64.61 76.34,62.71 73.21,62.71 JP26.4
  Bottom 0.61: v82.57,23.34 80.83,23.34 80.83,14.6 72.41,14.6 JP25.4
N$17  (via drill 0.35, 0.5)
  Top 0.406: U$1.12 52.88,44.77 53.2,45.09 v53.2,45.72
  Top 0.61: 29.23,40.64 R4.1 v28.12,40.64
  Bottom 0.406: v53.2,45.72 52.24,46.51 50.51,46.51 v49.71,45.72
  Bottom 0.61: v49.71,45.72 49.71,43.5 49,42.78 43.28,42.78 JP7.2 38.44,40.64 v28.12,40.64
N$18
  Top 0.457: U$1.6 48.98,42.7 47.52,41.24 C2.1
N$19  (via drill 0.3, 0.35, 0.5, 1 pad 2)  (1 unrouted)
  Top 0.457: U$22.11 v78.9,63.98 78.9,60.03 C30.2
  Top 0.559: U2.3 U2.4
  Top 0.61: Q12.3 88.61,22.22 | 87.65,18.26 87.65,11.75 84.16,11.75 84.16,14.13 82.57,14.13 D12.P$2
  Top 0.813: 87.65,18.26 Q12.3
  Top 1.016: 89.93,25.4 Q11.2 | Q11.2 89.93,20.6 Q12.3 | D13.P$1 82.57,27.94 89.93,27.94 Q11.2
  Top 1.8: U2.4 85.91,38.1 v87.81,38.1
  Bottom 0.508: v78.9,63.98 76.52,61.6 71.78,61.6 JP26.5
  Bottom 0.61: v86.38,18.42 v88.92,18.42 v90.19,18.42 | v87.65,18.42 v86.38,18.42 | v86.38,18.42 v85.11,18.42 v85.11,19.69 v86.38,19.69 v87.65,19.69 v88.92,19.69 v90.19,19.69 v90.19,20.95 v88.92,20.95 v87.65,20.95 v86.38,20.95 v85.11,20.95 v85.11,22.22 v82.57,22.22 81.62,22.22 81.62,13.65 70.83,13.65 JP25.5 | v85.11,23.49 v86.38,23.49 v87.65,23.49 v88.92,23.49 v90.19,23.49 v90.19,22.22 v88.92,22.22 v87.65,22.22 v86.38,22.22
  Bottom 0.813: v86.38,23.49 v86.38,22.22
  Bottom 1.8: 87.97,38.1 v87.81,38.1 82.57,38.1 82.57,26.99 86.38,26.99 v86.38,22.22
  pour Top (isolate 0.406, rank 3, no thermals): 81.62,11.11 88.76,11.11 88.76,14.29 90.99,14.29 90.83,28.58 81.62,28.58
  pour Bottom (isolate 0.406, rank 3, no thermals): 81.62,27.94 90.83,27.94 90.83,15.88 81.62,15.88
  pour Top (isolate 0.406, no thermals): 84.32,39.21 86.22,39.21 86.22,37.15 84.32,37.15
N$20
  Top 0.457: 45.73,51.85 U$1.28 | 45.73,51.85 45.73,54.77 46.54,54.77 46.85,55.09 46.85,55.98 R9.1 | R8.2 45.73,51.85
N$21
  Top 0.457: U$1.27 46.38,48.74 46.06,48.42 45.27,48.42 44.95,48.74 44.95,55.98 R13.1
N$22  (via drill 0.3, 0.35, 0.5)
  Top 0.406: U$1.4 47.68,45.09 v47.84,45.24
  Top 0.457: C2.2 47.52,39.69 46.22,39.69 46.22,42.23 47.17,42.23 47.68,42.74 U$1.4
  Top 0.61: Q2.3 27.01,56.83 | 30.98,55.88 37.49,55.88 37.49,52.39 35.11,52.39 35.11,50.8 D1.P$2 | v27.01,50.8 v27.01,53.34
  Top 0.813: 30.98,55.88 Q2.3
  Top 1.016: 23.84,58.16 Q1.2 | Q1.2 28.64,58.16 Q2.3 | D3.P$1 21.29,50.8 21.29,58.16 Q1.2
  Bottom 0.406: JP11.2 9.57,42.86 XH2.1
  Bottom 0.61: v30.82,54.61 v30.82,57.15 v30.82,58.42 | v30.82,55.88 v30.82,54.61 | v30.82,54.61 v30.82,53.34 v29.55,53.34 v29.55,54.61 v29.55,55.88 v29.55,57.15 v29.55,58.42 v28.28,58.42 v28.28,57.15 v28.28,55.88 v28.28,54.61 v28.28,53.34 v27.01,53.34 | v27.01,50.8 27.01,49.85 37.49,49.85 JP8.3 44.79,51.59 44.79,46.2 46.54,44.45 47.65,44.45 47.84,44.64 v47.84,45.24 | v25.74,53.34 v25.74,54.61 v25.74,55.88 v25.74,57.15 v25.74,58.42 v27.01,58.42 v27.01,57.15 v27.01,55.88 v27.01,54.61
  Bottom 0.813: v25.74,54.61 v27.01,54.61
  Bottom 1.8: v25.74,53.34 22.09,53.34 22.09,50.64 11.93,50.64 11.93,42.84 XH2.1
  pour Top (isolate 0.406, rank 3, no thermals): 38.12,49.85 38.12,56.99 34.95,56.99 34.95,59.21 20.66,59.05 20.66,49.85
  pour Bottom (isolate 0.406, rank 3, no thermals): 21.29,49.85 21.29,59.05 33.36,59.05 33.36,49.85
N$23
  Top 0.457: R15.1 49.55,51.43 48.33,51.43 U$1.24
N$24
  Top 0.457: U$1.8 50.28,41.37 49.79,41.35 49.79,41.25 C11.1
N$25  (via drill 0.35, 0.5)
  Top 0.406: U$1.5 48.33,44.77 v48.8,45.24
  Top 0.813: R2.2 v25.9,50.8
  Bottom 0.61: v25.9,50.8 25.9,49.05 39.23,49.05 JP8.4 43.84,50.17 43.84,45.56 45.74,43.66 48.28,43.66 48.8,44.18 v48.8,45.24
N$26  (via drill 0.3, 0.35, 0.5)
  Top 0.406: 52.23,40.98 U$1.11 52.23,45.09 v52.39,45.24
  Top 0.457: 52.23,40.98 C8.2
  Top 0.61: 30.66,45.72 37.49,45.72 37.49,42.23 35.11,42.23 35.11,40.64 D4.P$2 | Q4.3 27.17,45.72 | v27.01,40.64 v27.01,43.18
  Top 0.813: 30.66,45.72 Q4.3
  Top 1.016: Q3.2 28.64,48 Q4.3 | 23.84,48 Q3.2 | Q3.2 21.29,48 21.29,40.64 D5.P$1
  Bottom 0.406: v52.39,45.24 51.75,45.88 50.98,45.88 50.51,45.4 v50.51,45.24 | JP11.1 9.55,40.32
  Bottom 0.508: v50.51,45.24 50.51,42.55
  Bottom 0.61: v27.01,40.64 27.01,39.69 40.03,39.69 JP7.3 50.19,41.59 50.51,41.91 v50.51,45.24 | v25.74,43.18 v25.74,44.45 v25.74,45.72 v25.74,46.99 v25.74,48.26 v27.01,48.26 v27.01,46.99 v27.01,45.72 v27.01,44.45 v27.01,43.18 | v30.82,48.26 v30.82,46.99 v30.82,45.72 v30.82,44.45 v30.82,43.18 v29.55,43.18 v29.55,44.45 v29.55,45.72 v29.55,46.99 v29.55,48.26 v28.28,48.26 v28.28,46.99 v28.28,45.72 v28.28,44.45 v28.28,43.18 v27.01,43.18 | 26.69,43.18 v27.01,43.18
  Bottom 0.813: v27.01,44.45 v25.74,44.45
  Bottom 1.8: 25.74,43.5 21.61,43.5 21.61,40.32 9.55,40.32 XH2.2
  pour Top (isolate 0.406, rank 3, no thermals): 20.66,39.69 38.12,39.69 38.12,46.83 34.95,46.83 34.95,49.05 20.66,48.89
  pour Bottom (isolate 0.406, rank 3, no thermals): 33.36,39.69 21.29,39.69 21.29,48.89 33.36,48.89
N$27  (via drill 0.35, 0.5)
  Top 0.406: U$1.3 47.03,45.09 v46.87,45.24
  Top 0.813: R1.1 v28.12,50.8
  Bottom 0.61: v28.12,50.8 35.9,50.8 JP8.2 45.9,53.02 45.9,46.21 v46.87,45.24
N$35  (via drill 0.35, 0.5)  (1 unrouted)
  Top 0.34: U$22.12 v79.55,64.61
  Top 0.813: R36.1 v82.57,21.11
  Bottom 0.34: 79.55,63.51 79.56,63.49
  Bottom 0.508: v79.55,64.61 79.72,64.44 79.72,63.66 79.56,63.51 79.56,63.49 76.39,60.32 70.51,60.32 JP26.6
  Bottom 0.61: JP25.6 82.57,12.38 v82.57,21.11
N$39  (via drill 0.35)  (1 unrouted)
  Top 0.34: U$22.5 v75,64.61
  Top 0.61: JP25.1 70.09,24.55 R39.2
  Bottom 0.508: JP26.1 72.73,70.8 72.73,66.67 73.21,66.2 74.32,66.2 75,65.52 v75,64.61
N$40  (via drill 0.35)  (1 unrouted)
  Top 0.34: U$22.3 v73.7,64.61
  Top 0.61: JP25.3 72.41,20 R38.1
  Bottom 0.508: v73.7,64.61 72.57,64.61 71.13,66.06 71.13,67.33 JP26.3
N$47
  Bottom 0.406: 19.39,20.95 19.39,26.03 25.74,26.03 25.74,29.85 45.22,29.85 X5.1 | 19.39,20.95 DC2.5 25.74,20.95 25.74,19.69 45.22,19.69 X6.1 | 19.39,20.95 19.39,15.88 U$5.5 C7.2
N$48
  Bottom 0.406: X5.3 45.22,20.95 32.09,20.95 U$5.2
N$49
  Bottom 0.406: X5.2@1 52.41,28.74 52.41,26.03 | U$5.3 29.55,27.31 42.25,27.31 42.25,26.03 52.41,26.03 | 52.41,26.03 52.41,23.33 X5.2@2
N$50
  Bottom 0.406: DC2.2 13.04,28.58 13.04,21.92 X7.4
N$51
  Bottom 0.406: DC2.1 24.47,31.11 24.47,27.31 16.85,27.31 16.85,14.92 | 16.85,14.6 16.85,14.92 | 16.85,14.92 X7.1
N$52
  Bottom 0.406: C12.2 C13.2 U$5.8
N$53
  Bottom 0.406: R11.1 C12.1 C13.1
N$54
  Bottom 0.406: R11.2 34.63,24.76 U$5.1
N$55
  Bottom 0.406: U$5.4 DC2.4
N$56
  Bottom 0.406: DC2.6 32.09,18.42 U$5.7
N$57
  Bottom 0.406: U$5.6 R12.1
N$58  (1 unrouted)
  Bottom 0.406: C7.1 27.01,5.71 C14.1
N$59
  Bottom 0.406: C14.2 42.25,5.71 42.25,12.06 52.41,12.06 | 52.41,12.06 52.41,14.76 X6.2@1 | X6.2@2 52.95,12.06 52.41,12.06
N$81
  Top 0.508: IC1.7 85.34,83.03 Q10.1
N$82
  Top 0.508: IC1.8 82.77,79.86 Q10.3
N$83  (via drill 0.35)
  Top 0.508: IC1.29 v90.41,75.97
  Bottom 0.508: JP23.5 84.48,63.02 85.75,64.29 87.49,64.29 87.81,64.61 87.81,73.73 90.04,75.97 v90.41,75.97
N$84  (via drill 0.35)
  Top 0.508: IC1.17 | R40.1 v76.06,82.87
  Top 0.55: IC1.17 v84.54,72.39
  Bottom 0.508: v76.06,82.87 77.97,80.96 84.54,80.96 v84.54,72.39 84.54,71.18 82.41,69.06 82.41,66.99 JP23.3
N$85  (via drill 0.35)
  Top 0.508: R42.1 v76.06,80.96 | IC1.16 83.37,72.77 v83.37,71.6 83.37,68.58 JP23.1
  Bottom 0.508: v76.06,80.96 76.86,80.17 83.68,80.17 83.68,71.91 v83.37,71.6
N$86  (via drill 0.35)
  Top 0.508: v76.06,79.06 R41.1 | JP23.4 85.11,66.83 82.41,66.83 v82.41,71.6 81.78,72.23 81.78,73.25 82.1,73.56 IC1.15
  Bottom 0.508: v76.06,79.06 76.38,79.38 82.97,79.38 82.97,73.26 82.41,72.71 v82.41,71.6
N$89
  Top 0.61: R36.2 84.21,18.2 84.21,16.56 85.37,16.56 Q12.1
N$90
  Top 1.27: R37.1 85.37,26.25 Q11.1
N$91
  Top 0.61: Q18.1 75.21,16.45 74,16.45 74,18.2 R38.2
N$92
  Top 1.27: Q13.1 75.21,26.25 R39.1
N$93
  Top 0.813: SJ8.1 R44.2
N$94
  Top 0.457: C29.1 80.2,70.91 U$22.16
N$95
  Top 0.457: C29.2 80.51,72.61 80.85,72.27 U$22.15
N$96
  Top 0.457: C30.1 78.79,58.74 77.97,58.74 77.6,59.11 U$22.9
N$97
  Top 0.457: U$22.6 75.65,61.75 74.19,60.3 C25.1
N$98
  Top 0.457: 72.4,70.91 U$22.28 | 72.4,70.91 72.4,73.82 73.21,73.82 73.52,74.14 73.52,75.03 R48.1 | R47.2 72.4,70.91
N$99
  Top 0.457: U$22.27 73.05,67.79 72.73,67.47 71.94,67.47 71.62,67.79 71.62,75.03 R49.1
N$100
  Top 0.559: C31.1 87.81,41.75 87.76,41.7 84.64,41.7 U2.6
N$101  (via drill 0.35)
  Top 0.508: v88.76,78.11 89.34,78.68 IC1.2
  Bottom 0.508: v88.76,78.11 88.76,88.27 JP24.2
N$102  (via drill 0.35)
  Top 0.508: v87.97,77.31 89.01,77.31 90.14,78.44 IC1.1
  Bottom 0.508: JP24.1 81.14,87.31 87.97,87.31 v87.97,77.31
N$103
  Top 1.016: R40.2 U$26.P$1
N$104
  Top 1.016: U$27.P$1 R42.2
N$105
  Top 1.016: U$28.P$1 R41.2
N$106
  Top 0.559: U2.2 U2.1
  Top 1.8: U2.1 77.81,38.2 XH7.2
  pour Top (isolate 0.406, rank 2, no thermals): 81.78,39.21 83.68,39.21 83.68,37.15 81.78,37.15
N$107  (via drill 0.35)
  Top 0.508: v82.57,85.57 SJ6.1 | v86.38,75.72 89.34,72.77 IC1.23
  Bottom 0.508: v82.57,85.57 86.38,85.57 v86.38,75.72
N$108  (via drill 0.35)
  Top 0.508: v84.48,86.36 SJ7.1 | IC1.24 90.14,73.08 87.18,76.04 v87.18,76.52
  Bottom 0.508: v84.48,86.36 87.18,86.36 v87.18,76.52
N$109
  Top 0.813: SJ4.1 R43.2
N$110
  Top 0.508: 85.59,55.09 85.59,58.1 90.03,62.55 U$34.EXP
  Top 0.61: 85.59,55.09 JP31.2
N$111
  Top 0.508: SJ10.EXP 88.61,68.42 88.61,62.86 84,58.26 JP31.1
N$112  (via drill 0.35)
  Top 0.508: U$34.1 v92.42,63.18
  Top 0.55: IC1.32 v92.73,78.36
  Bottom 0.508: v92.73,78.36 92.42,78.05 92.42,76.99 93.37,76.04 93.37,66.67 91.46,64.77 91.46,64.14 v92.42,63.18
N$113  (via drill 0.35)
  Top 0.508: v92.42,64.45 U$34.2
  Top 0.55: IC1.31 v93.21,77.56
  Bottom 0.508: 94.16,77.56 v93.21,77.56 | v92.42,64.45 94.16,66.2 94.16,77.56 | JP32.2 94.16,81.6 94.16,77.56
N$114
  Top 0.508: 92.73,76.77 IC1.30 94,76.77 | 94,76.77 94,69.69 92.1,67.79 SJ10.1 | JP32.1 94,79.22 94,76.77
N$115  (via drill 0.35)
  Top 0.508: U$34.3 v92.42,66.83 | R44.1 89.24,85.72 v90.35,85.72 | IC1.28 v90.43,75.16
  Bottom 0.508: v92.42,66.83 91.15,68.1 91.15,75.16 | v90.35,85.72 91.15,84.93 91.15,75.16 | v90.43,75.16 91.15,75.16
N$116  (via drill 0.35)
  Top 0.508: IC1.27 | R43.1 87.34,84.77 87.65,84.45 v90.35,84.45 | SJ10.3 91.38,69.18 93.05,70.85 93.05,73.82 92.5,74.36 IC1.27 | v90.35,76.99 90.19,76.99 89.48,76.28 89.48,74.93 90.04,74.36 IC1.27
  Bottom 0.508: v90.35,76.99 v90.35,84.45
N$119
  Top 0.457: R50.1 75.75,70.49 75,70.49 U$22.24
N$120
  Top 0.457: U$22.8 76.95,61.85 76.46,61.36 76.46,60.3 C34.1
N$131
  Bottom 1.27: R55.1 17.8,69.85 OK2.6
N$132  (via drill 3 pad 5)
  Bottom 1.27: U$36.2 13.68,86.04 13.68,84.14 | R55.2 20.66,76.83 19.71,75.88 9.55,75.88 R54.2 9.55,81.14 13.68,81.14 13.68,84.14 | 13.68,84.14 25.42,84.45 27.33,82.55 32.09,82.55 33.68,84.14 39.39,84.14 41.93,81.6 53,81.6 v53.66,80.94
N$133
  Bottom 1.27: U$36.1 8.28,83.5 7.01,82.23 7.01,74.61 7.96,73.66 10.18,73.66 12.72,71.12 OK2.4
N$134
  Bottom 1.27: U$36.3 8.91,88.58 4.15,83.82 X1.2 4.15,73.66 6.37,71.44 R54.1
N$135
  Bottom 1.27: R56.2 22.88,79.06 21.93,80.01 18.75,80.01 17.8,79.06 OK2.1
N$136
  Bottom 1.27: R56.1 27.03,74 CN2.1
N$137  (via drill 3 pad 5)
  Bottom 1.27: X1.1 6.69,91.12 14.63,91.12 15.9,89.85 31.45,89.85 33.99,87.31 39.07,87.31 42.25,90.49 53.22,90.49 v53.66,90.94
N$138
  Bottom 1.27: CN2.2 29.53,77.15 24.45,82.23 18.12,82.23 15.26,79.38 OK2.2
PHASE_正転逆転  (via drill 0.35)  (1 unrouted)
  Top 0.406: U$1.19 51.58,48.46 v51.74,48.3
  Top 0.457: U$22.19 v78.25,67.66
  Top 0.55: v81.62,74.36 IC1.14
  Bottom 0.406: v51.74,48.3 53.84,48.3 54.63,47.5 54.63,41.75 JP9.1 | v81.62,74.36 79.56,74.36 79.56,71.6 78.25,70.29 v78.25,67.66
PWMH  (via drill 0.35)  (1 unrouted)
  Top 0.457: U$1.23 v48.98,48.64 | U$22.23 v75.65,67.69
  Top 0.55: v82.1,76.77 IC1.11
  Bottom 0.406: v48.98,48.64 48.98,50.8 55.27,50.8 57.17,48.89 JP9.4 | 75.67,67.71 75.67,70.45 77.65,72.43 77.65,75.88 78.53,76.77 v82.1,76.77
  Bottom 0.457: v48.98,48.64 49,48.66 | v75.65,67.69 75.67,67.71
PWML  (via drill 0.35)  (1 unrouted)
  Top 0.34: U$22.22 v76.3,66.99
  Top 0.406: v49.79,48.26 49.66,48.39 49.66,49.82 U$1.22
  Top 0.55: v81.62,75.97 IC1.12
  Bottom 0.34: v76.3,66.99 76.3,68.42
  Bottom 0.406: v49.79,48.26 49.79,50.01 54.16,50.01 55.88,48.28 55.88,45.42 JP9.3 | 76.3,68.42 76.3,70.13 78.29,72.11 78.29,75.56 78.69,75.97 v81.62,75.97
SR_ブレーキ  (via drill 0.35)  (1 unrouted)
  Top 0.406: v50.76,48.26 50.28,48.74 U$1.21
  Top 0.457: U$22.21 v76.95,67.69
  Top 0.55: v82.1,75.16 IC1.13
  Bottom 0.406: v50.76,48.26 50.76,49.21 54,49.21 55.27,47.94 55.27,43.5 JP9.2 | v76.95,67.69 76.95,69.94 78.92,71.91 78.92,75.25 82.01,75.25 v82.1,75.16
V1
  Top 0.457: U$1.20 50.93,52.55 51.3,52.92 51.3,55.51 | C10.1 49.39,54.77 47.81,54.77 47.49,54.45 47.49,53.56 R8.1
  Top 0.508: R6.1 R7.1 51.3,55.51 C10.1
V3
  Top 0.457: U$22.20 77.6,71.6 77.97,71.97 77.97,75.03 | C33.1 76.06,73.82 74.48,73.82 74.16,73.5 74.16,72.61 R47.1
  Top 0.508: R45.1 R46.1 77.97,75.03 C33.1
VCC2  (via drill 0.35)  (1 unrouted)
  Top 0.34: 53.53,43.81 53.53,43.5 | 80.2,62.86 80.2,62.55
  Top 0.406: C9.1 53.53,41.01 53.53,42.07 | 53.53,42.07 53.53,43.5 U$1.13 | v53.84,42.07 53.53,42.07 | D6.P$2 54.95,60.01 54.95,48.74 v53.68,47.47 | v80.67,64.61 80.2,64.14 80.2,62.86
  Top 0.457: C9.1 54,41.28 | R15.2 49.55,53.66 v48.44,53.66 | 76.22,51.43 D16.P$2 | C32.1 80.67,60.32 | U$22.13 80.2,62.55 80.2,61.28 v80.83,61.28 | R50.2 75.75,72.71 v76.86,72.71
  Top 0.61: v76.22,52.86 D16.P$2 | U$20.3 73.21,53.9 73.74,53.37 C27.1 76.22,51.75 76.22,51.43 | v80.83,61.28 C32.1
  Bottom 0.305: 48.33,49.85 48.33,47.47
  Bottom 0.34: 75,66.95 75,68.42
  Bottom 0.406: v48.44,53.66 48.33,53.66 48.33,49.85 | v53.84,42.07 53.84,45.24 54,45.4 54,47.15 v53.68,47.47 48.33,47.47 | v76.86,72.71 75,70.85 75,68.42
  Bottom 0.508: v80.67,64.61 80.67,65.09 79.56,66.2 75.75,66.2 75,66.95
  Bottom 0.61: v80.83,61.28 76.22,56.67 v76.22,52.86

### Text on the board
tNames: Encoder | i2c / Pullup | GND | J0 | J1 | 5v | E1 | G | E2 | L2 | T | L1 | R | L0 | JI | JU | JP | JI | JU | - | LS | GND | + | LG | I0 | HS | F2 | control | I1 | F1 | input | HG | GND | - | + | LS | H | Motor | LG | L | HS | S | - | HG | P | + | Motor | - | +
bNames: 2017/09 / ver.1.0 | mode | J0 | J1 | JP | JU | JI | TEST | 0 | 0 | 0 | 1 | 0 | 1 | 0 | 1 | 0 | 0 | PWM | UART | 0 | 1 | 0 | 1 | 0 | 1 | 1 | 0 | 0 | 1 | I2C | I0 | SDA,TX,NC | Battery / Supply / 5-35V | I1 | SCL,RX,PWM
tDocu: 2014.9 / Y.Muraoka / Waseda Univ.